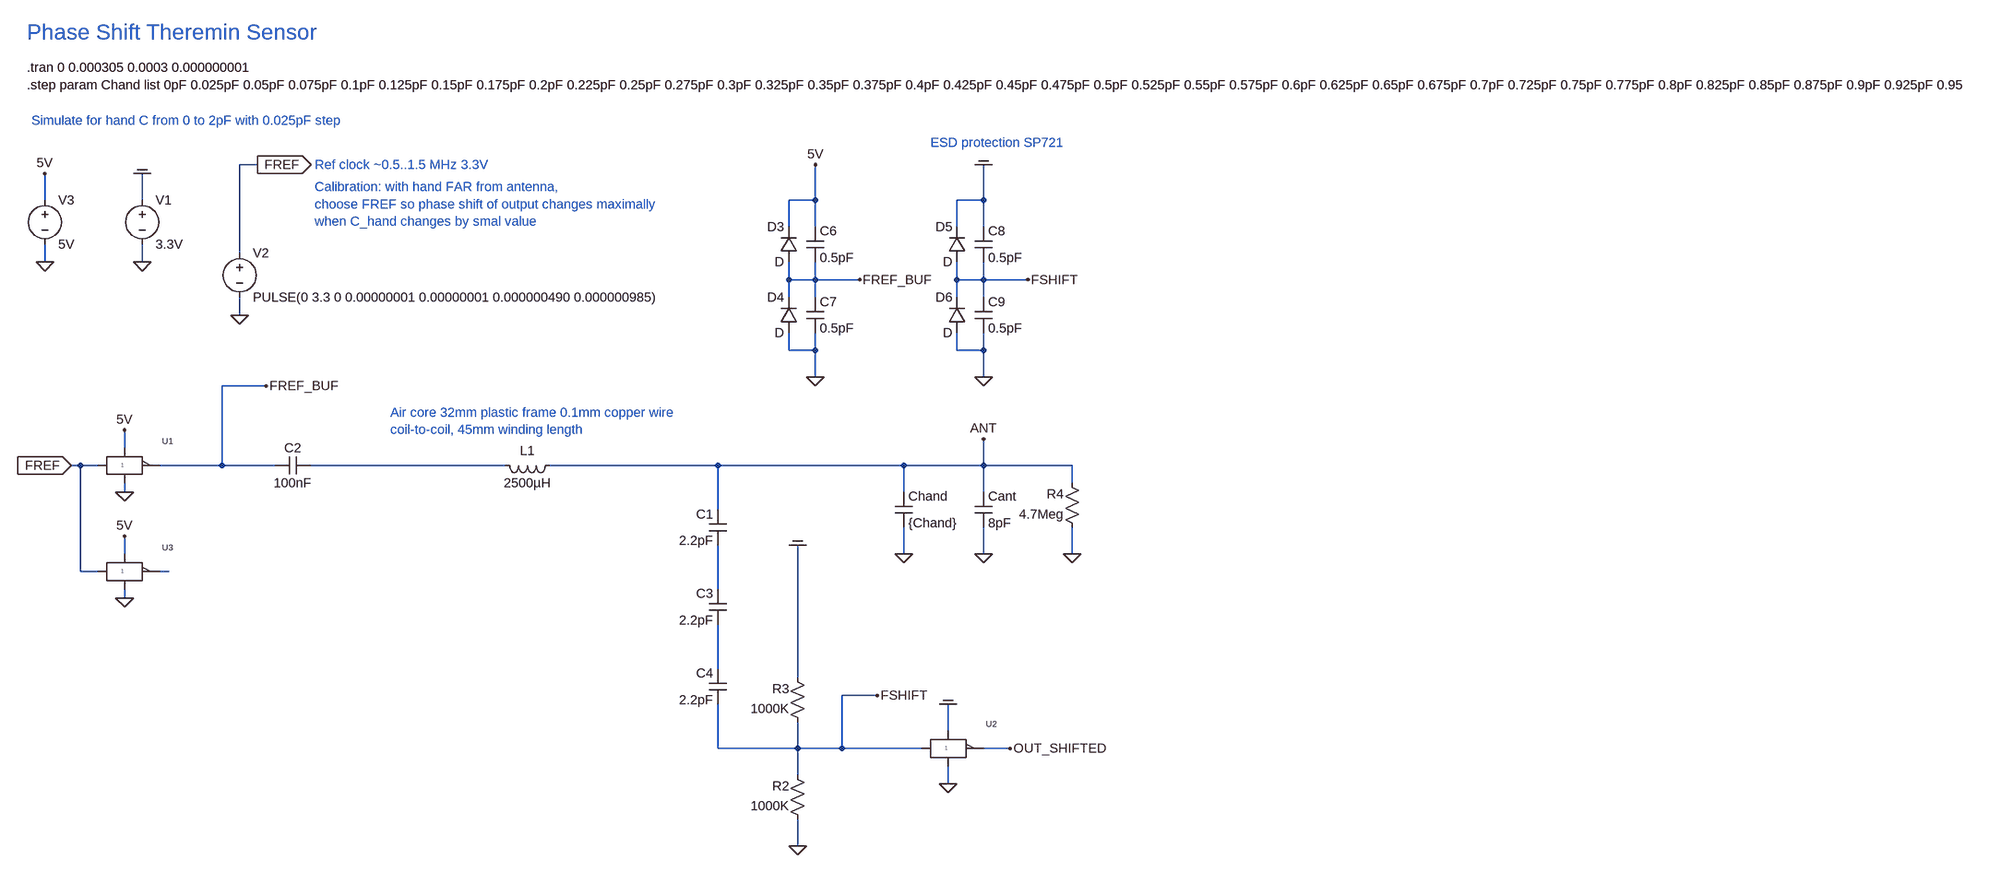
[diagram p0: schematic phase_shift_sensor_2500uH_serial_lc_v5.asc]
phase_shift_sensor_2500uH_serial_lc_v5.asc, the LTspice schematic file:
Version 4
SHEET 1 8128 1652
WIRE 448 -128 416 -128
WIRE 64 -64 64 -112
WIRE 240 -64 240 -112
WIRE 1456 -64 1456 -128
WIRE 1456 -64 1408 -64
WIRE 1760 -64 1760 -128
WIRE 1760 -64 1712 -64
WIRE 1408 -16 1408 -64
WIRE 1456 -16 1456 -64
WIRE 1712 -16 1712 -64
WIRE 1760 -16 1760 -64
WIRE 416 32 416 -128
WIRE 64 48 64 16
WIRE 240 48 240 16
WIRE 1408 80 1408 48
WIRE 1456 80 1456 48
WIRE 1456 80 1408 80
WIRE 1536 80 1456 80
WIRE 1712 80 1712 48
WIRE 1760 80 1760 48
WIRE 1760 80 1712 80
WIRE 1840 80 1760 80
WIRE 1408 112 1408 80
WIRE 1456 112 1456 80
WIRE 1712 112 1712 80
WIRE 1760 112 1760 80
WIRE 416 144 416 112
WIRE 1408 208 1408 176
WIRE 1456 208 1456 176
WIRE 1456 208 1408 208
WIRE 1712 208 1712 176
WIRE 1760 208 1760 176
WIRE 1760 208 1712 208
WIRE 1456 256 1456 208
WIRE 1760 256 1760 208
WIRE 464 272 384 272
WIRE 208 384 208 352
WIRE 128 416 112 416
WIRE 160 416 128 416
WIRE 384 416 384 272
WIRE 384 416 272 416
WIRE 480 416 384 416
WIRE 896 416 544 416
WIRE 1280 416 976 416
WIRE 1616 416 1280 416
WIRE 1760 416 1760 368
WIRE 1760 416 1616 416
WIRE 1920 416 1760 416
WIRE 1920 448 1920 416
WIRE 208 464 208 448
WIRE 1616 464 1616 416
WIRE 1760 464 1760 416
WIRE 1280 496 1280 416
WIRE 208 576 208 544
WIRE 1616 576 1616 528
WIRE 1760 576 1760 528
WIRE 1920 576 1920 528
WIRE 128 608 128 416
WIRE 160 608 128 608
WIRE 288 608 272 608
WIRE 1280 640 1280 560
WIRE 208 656 208 640
WIRE 1280 784 1280 704
WIRE 1424 800 1424 560
WIRE 1568 832 1504 832
WIRE 1696 896 1696 848
WIRE 1280 928 1280 848
WIRE 1424 928 1424 880
WIRE 1424 928 1280 928
WIRE 1504 928 1504 832
WIRE 1504 928 1424 928
WIRE 1648 928 1504 928
WIRE 1808 928 1760 928
WIRE 1424 976 1424 928
WIRE 1696 992 1696 960
WIRE 1424 1104 1424 1056
FLAG 240 48 0
FLAG 448 -128 FREF
IOPIN 448 -128 Out
FLAG 416 144 0
FLAG 1760 368 ANT
FLAG 1760 576 0
FLAG 1616 576 0
FLAG 240 -112 COM
FLAG 1456 256 0
FLAG 1760 256 0
FLAG 1760 -128 COM
FLAG 1568 832 FSHIFT
FLAG 1808 928 OUT_SHIFTED
FLAG 1840 80 FSHIFT
FLAG 112 416 FREF
IOPIN 112 416 In
FLAG 1536 80 FREF_BUF
FLAG 464 272 FREF_BUF
FLAG 1424 560 COM
FLAG 1920 576 0
FLAG 1424 1104 0
FLAG 208 464 0
FLAG 1696 992 0
FLAG 1696 848 COM
FLAG 64 48 0
FLAG 64 -112 5V
FLAG 208 352 5V
FLAG 1456 -128 5V
FLAG 208 656 0
FLAG 208 544 5V
SYMBOL voltage 240 -80 R0
WINDOW 123 0 0 Left 2
WINDOW 39 0 0 Left 2
SYMATTR InstName V1
SYMATTR Value 3.3V
SYMBOL voltage 416 16 R0
WINDOW 123 0 0 Left 2
WINDOW 39 0 0 Left 2
SYMATTR InstName V2
SYMATTR Value PULSE(0 3.3 0 0.00000001 0.00000001 0.000000490 0.000000985)
SYMBOL cap 1744 464 R0
SYMATTR InstName Cant
SYMATTR Value 8pF
SYMBOL cap 1600 464 R0
SYMATTR InstName Chand
SYMATTR Value {Chand}
SYMBOL diode 1424 48 R180
WINDOW 0 24 64 Left 2
WINDOW 3 24 0 Left 2
SYMATTR InstName D3
SYMBOL diode 1424 176 R180
WINDOW 0 24 64 Left 2
WINDOW 3 24 0 Left 2
SYMATTR InstName D4
SYMBOL cap 1440 -16 R0
SYMATTR InstName C6
SYMATTR Value 0.5pF
SYMBOL cap 1440 112 R0
SYMATTR InstName C7
SYMATTR Value 0.5pF
SYMBOL diode 1728 48 R180
WINDOW 0 24 64 Left 2
WINDOW 3 24 0 Left 2
SYMATTR InstName D5
SYMBOL diode 1728 176 R180
WINDOW 0 24 64 Left 2
WINDOW 3 24 0 Left 2
SYMATTR InstName D6
SYMBOL cap 1744 -16 R0
SYMATTR InstName C8
SYMATTR Value 0.5pF
SYMBOL cap 1744 112 R0
SYMATTR InstName C9
SYMATTR Value 0.5pF
SYMBOL cap 1296 560 R180
WINDOW 0 24 56 Left 2
WINDOW 3 24 8 Left 2
SYMATTR InstName C1
SYMATTR Value 2.2pF
SYMBOL res 1440 896 R180
WINDOW 0 31 76 Left 2
WINDOW 3 31 40 Left 2
SYMATTR InstName R3
SYMATTR Value 1000K
SYMBOL res 1440 1072 R180
WINDOW 0 31 76 Left 2
WINDOW 3 31 40 Left 2
SYMATTR InstName R2
SYMATTR Value 1000K
SYMBOL res 1936 544 R180
WINDOW 0 31 76 Left 2
WINDOW 3 31 40 Left 2
SYMATTR InstName R4
SYMATTR Value 4.7Meg
SYMBOL ind 992 400 R90
WINDOW 0 5 56 VBottom 2
WINDOW 3 32 56 VTop 2
SYMATTR InstName L1
SYMATTR Value 2500µH
SYMATTR SpiceLine Ipk=0.01 Rser=118 Rpar=1.874Meg Cpar=1.084pF
SYMBOL SBORKA\\Logika\\74AHC1G04 208 368 R0
SYMATTR InstName U1
SYMBOL SBORKA\\Logika\\74AHC1G04 1696 880 R0
SYMATTR InstName U2
SYMBOL voltage 64 -80 R0
WINDOW 123 0 0 Left 2
WINDOW 39 0 0 Left 2
SYMATTR InstName V3
SYMATTR Value 5V
SYMBOL cap 1296 704 R180
WINDOW 0 24 56 Left 2
WINDOW 3 24 8 Left 2
SYMATTR InstName C3
SYMATTR Value 2.2pF
SYMBOL cap 1296 848 R180
WINDOW 0 24 56 Left 2
WINDOW 3 24 8 Left 2
SYMATTR InstName C4
SYMATTR Value 2.2pF
SYMBOL cap 544 400 R90
WINDOW 0 0 32 VBottom 2
WINDOW 3 32 32 VTop 2
SYMATTR InstName C2
SYMATTR Value 100nF
SYMBOL SBORKA\\Logika\\74AHC1G04 208 560 R0
SYMATTR InstName U3
TEXT 32 -304 Left 2 !.tran 0 0.000305 0.0003 0.000000001
TEXT 32 -272 Left 2 !.step param Chand list 0pF 0.025pF 0.05pF 0.075pF 0.1pF 0.125pF 0.15pF 0.175pF 0.2pF 0.225pF 0.25pF 0.275pF 0.3pF 0.325pF 0.35pF 0.375pF 0.4pF 0.425pF 0.45pF 0.475pF 0.5pF 0.525pF 0.55pF 0.575pF 0.6pF 0.625pF 0.65pF 0.675pF 0.7pF 0.725pF 0.75pF 0.775pF 0.8pF 0.825pF 0.85pF 0.875pF 0.9pF 0.925pF 0.95pF 0.975pF 1pF 1.025pF 1.05pF 1.075pF 1.1pF 1.125pF 1.15pF 1.175pF 1.2pF 1.225pF 1.25pF 1.275pF 1.3pF 1.325pF 1.35pF 1.375pF 1.4pF 1.425pF 1.45pF 1.475pF 1.5pF 1.525pF 1.55pF 1.575pF 1.6pF 1.625pF 1.65pF 1.675pF 1.7pF 1.725pF 1.75pF 1.775pF 1.8pF 1.825pF 1.85pF 1.875pF 1.9pF 1.925pF 1.95pF 1.975pF 2.0pF
TEXT 552 -128 Left 2 ;Ref clock ~0.5..1.5 MHz 3.3V
TEXT 32 -368 Left 4 ;Phase Shift Theremin Sensor
TEXT 688 320 Left 2 ;Air core 32mm plastic frame 0.1mm copper wire \ncoil-to-coil, 45mm winding length
TEXT 1664 -168 Left 2 ;ESD protection SP721
TEXT 552 -88 Left 2 ;Calibration: with hand FAR from antenna,\nchoose FREF so phase shift of output changes maximally \nwhen C_hand changes by smal value
TEXT 40 -208 Left 2 ;Simulate for hand C from 0 to 2pF with 0.025pF step

The netlist it stands for:
* phase_shift_sensor_2500uH_serial_lc_v5.asc
V1 COM 0 3.3V
V2 FREF 0 PULSE(0 3.3 0 0.00000001 0.00000001 0.000000490 0.000000985)
Cant ANT 0 8pF
Chand ANT 0 {Chand}
D3 FREF_BUF 5V D
D4 0 FREF_BUF D
C6 5V FREF_BUF 0.5pF
C7 FREF_BUF 0 0.5pF
D5 FSHIFT COM D
D6 0 FSHIFT D
C8 COM FSHIFT 0.5pF
C9 FSHIFT 0 0.5pF
C1 N003 ANT 2.2pF
R3 FSHIFT COM 1000K
R2 0 FSHIFT 1000K
R4 0 ANT 4.7Meg
L1 ANT N001 2500µH Ipk=0.01 Rser=118 Rpar=1.874Meg Cpar=1.084pF
XU1 FREF FREF_BUF 5V 0 74AHC1G04  ; pins in out vcc gnd
XU2 FSHIFT OUT_SHIFTED COM 0 74AHC1G04  ; pins in out vcc gnd
V3 5V 0 5V
C3 N004 N003 2.2pF
C4 FSHIFT N004 2.2pF
C2 N001 FREF_BUF 100nF
XU3 FREF N002 5V 0 74AHC1G04  ; pins in out vcc gnd
.model D D
.lib standard.dio
.tran 0 0.000305 0.0003 0.000000001
.step param Chand list 0pF 0.025pF 0.05pF 0.075pF 0.1pF 0.125pF 0.15pF 0.175pF 0.2pF 0.225pF 0.25pF 0.275pF 0.3pF 0.325pF 0.35pF 0.375pF 0.4pF 0.425pF 0.45pF 0.475pF 0.5pF 0.525pF 0.55pF 0.575pF 0.6pF 0.625pF 0.65pF 0.675pF 0.7pF 0.725pF 0.75pF 0.775pF 0.8pF 0.825pF 0.85pF 0.875pF 0.9pF 0.925pF 0.95pF 0.975pF 1pF 1.025pF 1.05pF 1.075pF 1.1pF 1.125pF 1.15pF 1.175pF 1.2pF 1.225pF 1.25pF 1.275pF 1.3pF 1.325pF 1.35pF 1.375pF 1.4pF 1.425pF 1.45pF 1.475pF 1.5pF 1.525pF 1.55pF 1.575pF 1.6pF 1.625pF 1.65pF 1.675pF 1.7pF 1.725pF 1.75pF 1.775pF 1.8pF 1.825pF 1.85pF 1.875pF 1.9pF 1.925pF 1.95pF 1.975pF 2.0pF
* Ref clock ~0.5..1.5 MHz 3.3V
* Phase Shift Theremin Sensor
* Air core 32mm plastic frame 0.1mm copper wire
* coil-to-coil, 45mm winding length
* ESD protection SP721
* Calibration: with hand FAR from antenna,
* choose FREF so phase shift of output changes maximally
* when C_hand changes by smal value
* Simulate for hand C from 0 to 2pF with 0.025pF step
.lib 74AHC1G04.cir
.backanno
.end